# EAGLE design ADE7763_Breakout (EAGLE 7.4.0)
CNAME: ADE7763 Breakout; CREVISION: 0.1; DESIGNER: Tisham Dhar
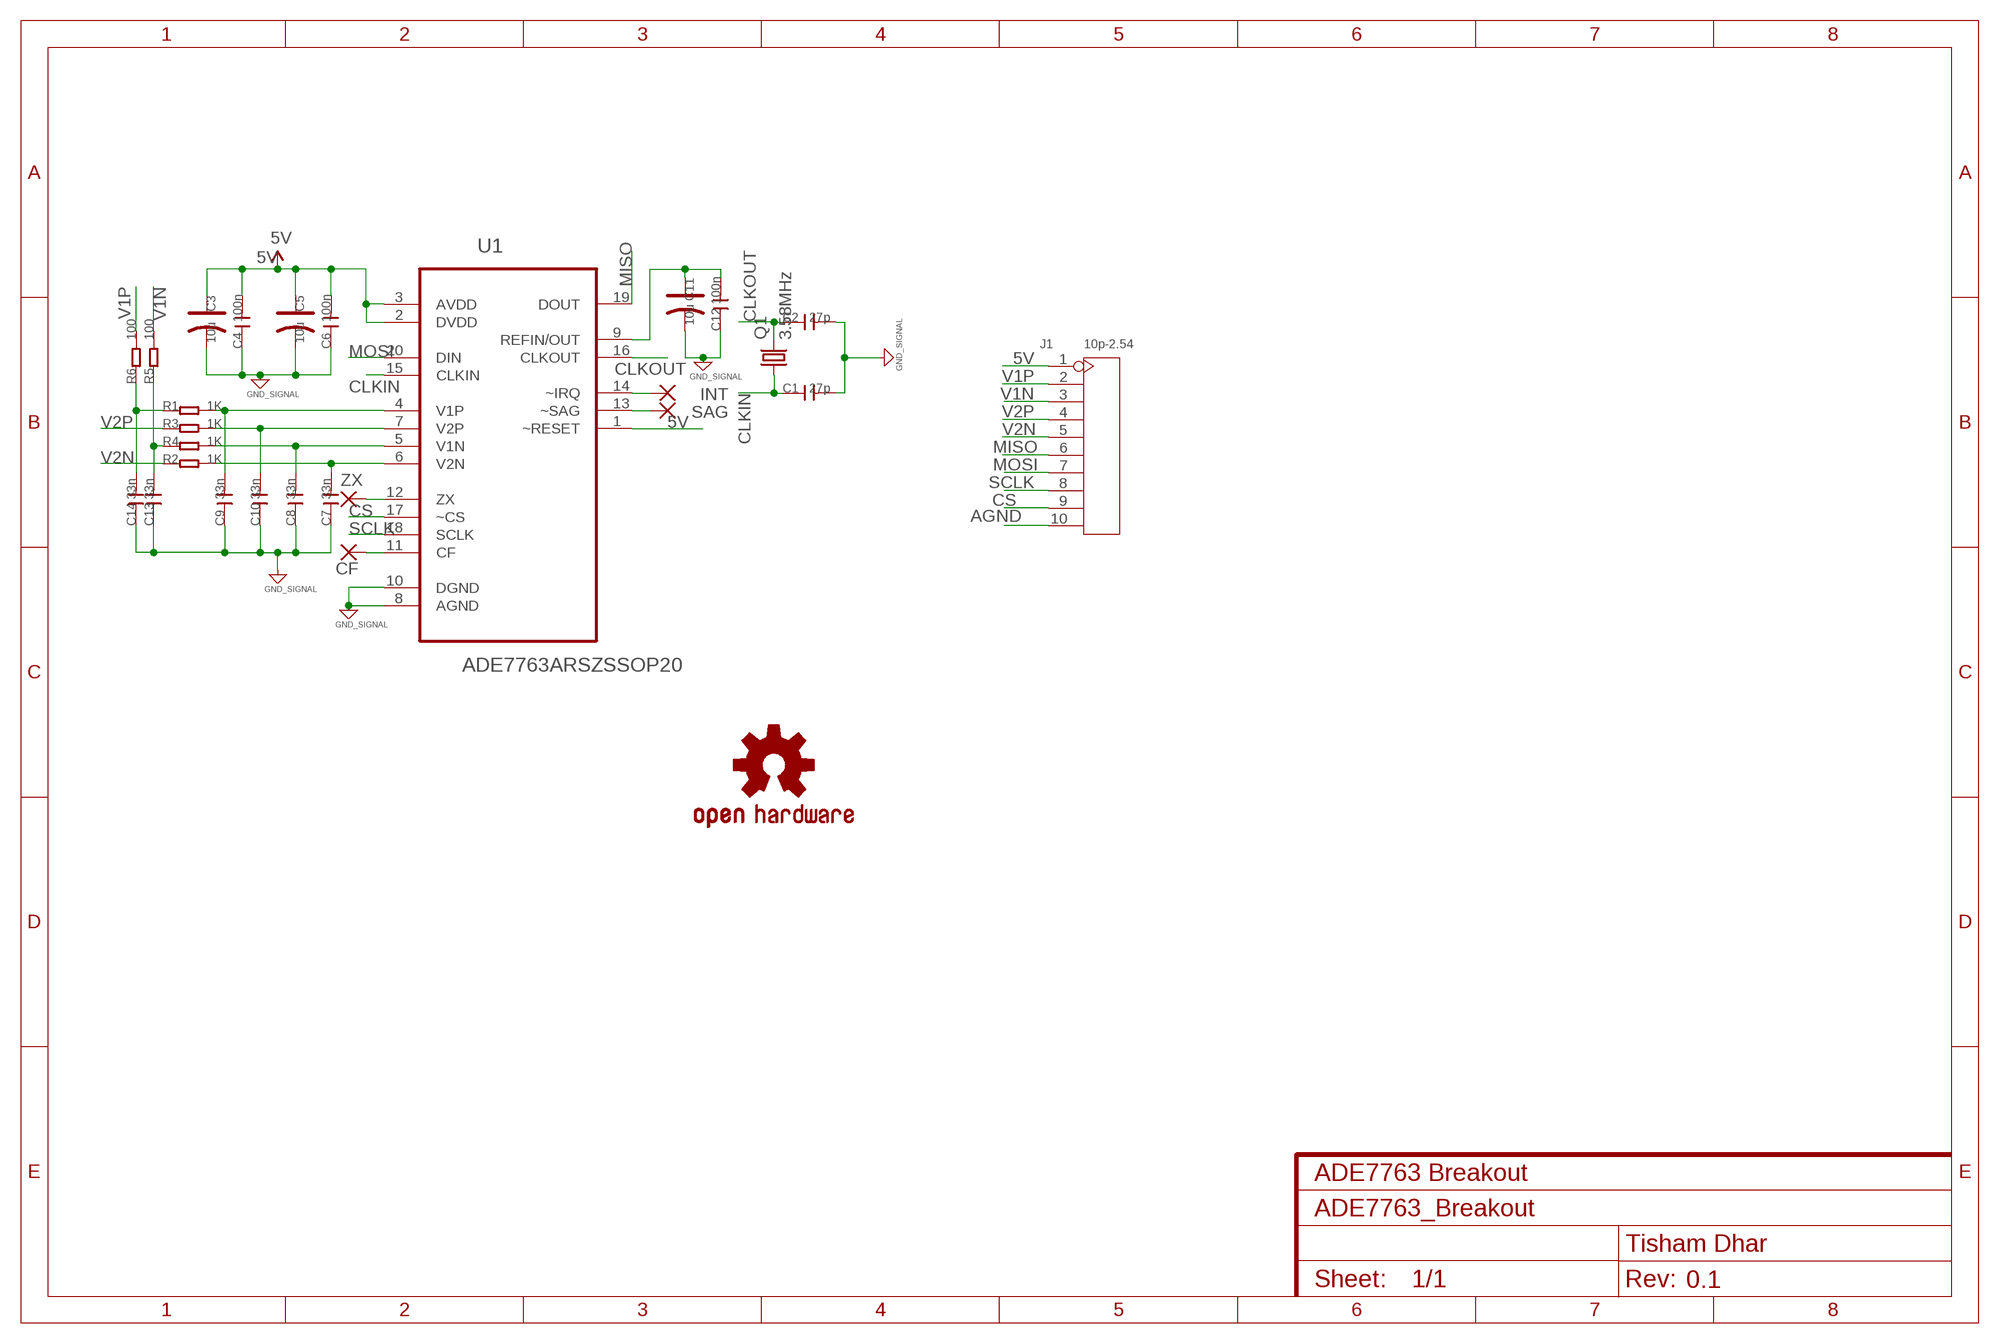
[diagram p0: schematic, sheet 1]

## Parts
C1  27p  C-0603  [C0603]
C2  27p  C-0603  [C0603]
C3  10u  CAP-AVX-A  [AVX-A]
C4  100n  C-0603  [C0603]
C5  10u  CAP-AVX-A  [AVX-A]
C6  100n  C-0603  [C0603]
C7  33n  C-0603  [C0603]
C8  33n  C-0603  [C0603]
C9  33n  C-0603  [C0603]
C10  33n  C-0603  [C0603]
C11  10u  CAP-AVX-A  [AVX-A]
C12  100n  C-0603  [C0603]
C13  33n  C-0603  [C0603]
C14  33n  C-0603  [C0603]
CF  WIREPADSMD1,27-254  [SMD1,27-2,54]
INT  WIREPADSMD1,27-254  [SMD1,27-2,54]
J1  10p-2.54  DIP-BLACK-MALE-HEADER-VERT(10P-2.54)  [H10-2.54]
LOGO1  OSHW-LOGOM  [OSHW-LOGO-M]
Q1  3.58MHz  CRYSTALHC49UP  [HC49UP]
R1  1K  R-0603  [R0603]
R2  1K  R-0603  [R0603]
R3  1K  R-0603  [R0603]
R4  1K  R-0603  [R0603]
R5  100  R-0603  [R0603]
R6  100  R-0603  [R0603]
SAG  WIREPADSMD1,27-254  [SMD1,27-2,54]
U1  ADE7763ARSZSSOP20  [RS_20-M]
ZX  WIREPADSMD1,27-254  [SMD1,27-2,54]

## Nets
5V [pwr]: C3.+ C4.2 C5.+ C6.2 J1.1 U1.1(~RESET) U1.2(DVDD) U1.3(AVDD)
AGND [pwr]: C1.2 C2.2 C3.- C4.1 C5.- C6.1 C7.1 C8.1 C9.1 C10.1 C11.- C12.1 C13.1 C14.1 J1.10 U1.8(AGND) U1.10(DGND) ; supply symbol labelled GND_SIGNAL
CLKIN: C1.1 Q1.1 U1.15(CLKIN)
CLKOUT: C2.1 Q1.2 U1.16(CLKOUT)
CS: J1.9 U1.17(~CS)
MISO: J1.6 U1.19(DOUT)
MOSI: J1.7 U1.20(DIN)
N$1: C13.2 R4.1 R5.1
N$2: C14.2 R1.1 R6.1
N$3: INT.1(P) U1.14(~IRQ)
N$4: C7.2 R2.2 U1.6(V2N)
N$5: C8.2 R4.2 U1.5(V1N)
N$6: C10.2 R3.2 U1.7(V2P)
N$7: C9.2 R1.2 U1.4(V1P)
N$8: SAG.1(P) U1.13(~SAG)
N$9: C11.+ C12.2 U1.9(REFIN/OUT)
N$10: U1.12(ZX) ZX.1(P)
N$11: CF.1(P) U1.11(CF)
SCLK: J1.8 U1.18(SCLK)
V1N: J1.3 R5.2
V1P: J1.2 R6.2
V2N: J1.5 R2.1
V2P: J1.4 R3.1

## Library data of the parts
C1 C2 C4 C6-C10 C12-C14 = Discrete:C*: Ceramic Capacitors
C3 C5 C11 = Discrete:CAP*: Electrolytic Capacitors,Tantalum Capacitors and Super Capacitors
CF INT SAG ZX = wirepad:WIREPAD: Wire PAD connect wire on PCB
J1 = Seeed-OPL-Connector:DIP-BLACK-MALE-HEADER-VERT(10P-2.54): 320020050; MPN: P125-1110A0BS116AX
LOGO1 = SparkFun-Aesthetics:OSHW-LOGO: Open Source Hardware Logo This logo indicates the piece of hardware it is found on incorporates a OSHW license and/or adheres to the definition of open source hardware found here: http://freedomdefined.org/OSHW
Q1 = crystal:CRYSTAL: CRYSTAL; OC_FARNELL: unknown; OC_NEWARK: unknown
R1-R6 = Discrete:R*
U1 = Analog Devices_By_element14_Batch_1:ADE7763ARSZ: Single-Phase Active and Apparent Energy Metering IC

## Net classes
0 default: width 0.254 mm, drill 0.33 mm, clearance 0.152 mm
1 pwr: width 0.406 mm, drill 0.33 mm, clearance 0.254 mm

## Board
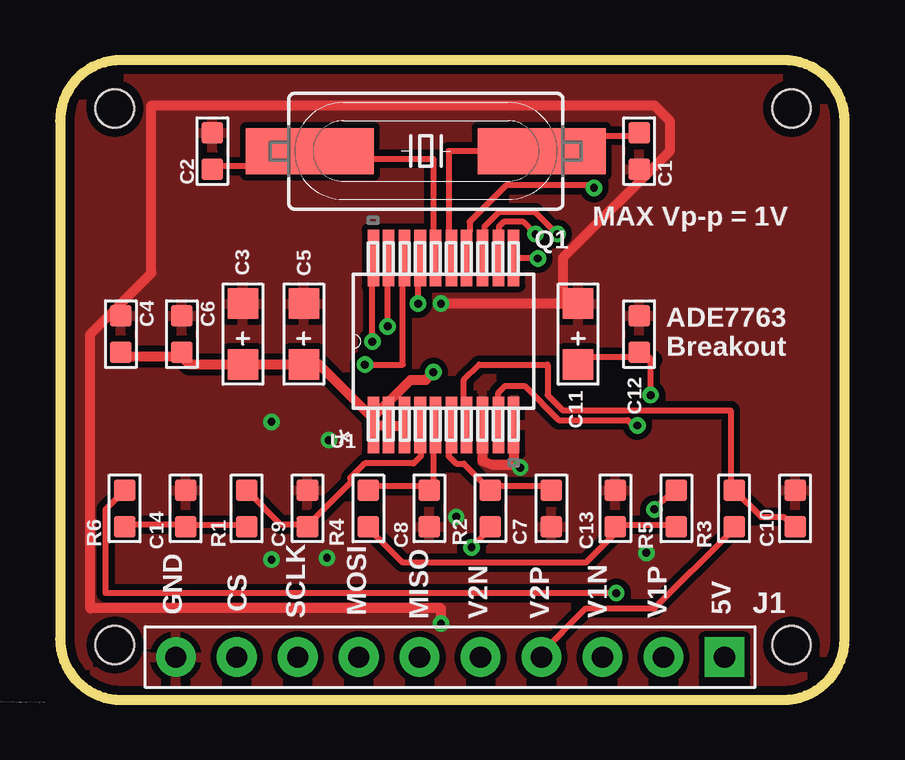
[diagram p1: board, top side]
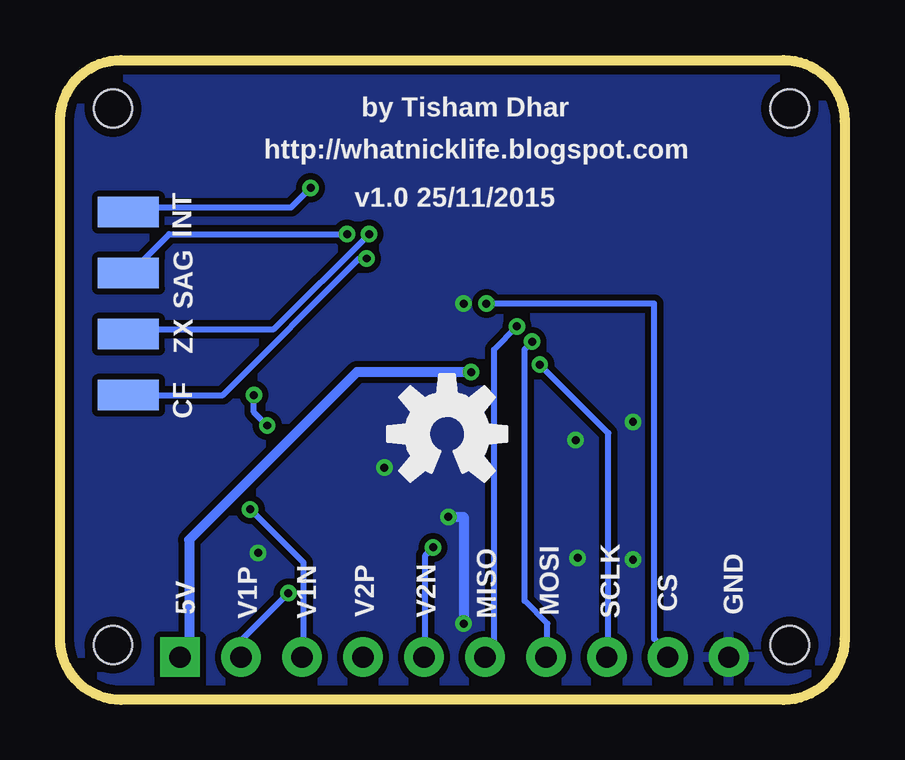
[diagram p2: board, bottom side, seen from below]

Size 32.69 x 26.66 mm. Coordinates in mm from the lower left corner, seen from the top.
Outline: 0,24.12 0,2.54 arc90 2.54,0 30.15,0 arc90 32.69,2.54 32.69,24.12 arc90 30.15,26.66 2.54,26.66 arc90 0,24.12
Copper layers (1*16): Top 0.0356mm / dielectric 1.5011mm / Bottom 0.0356mm
Design rules "OSHPark_2layer": minimum track width 6mil, minimum drill 13mil, track to track 6mil, track to pad 6mil, pad to pad 6mil, via to via 6mil, smd to smd 6mil, copper to edge 15mil, drill to drill 6mil, minimum pad ring 7mil, minimum via ring 7mil, stop-mask expansion 3mil, vias tented up to drill 20mil, thermal gap 10mil
Holes 1.6 mm at 2.29,24.64 30.48,24.64 2.29,2.29 30.48,2.29

### Footprints (pad centres in the part's own frame; a part is rotated, then mirrored left to right if it is on the bottom)
C0603 = smd 0.889 x 0.889: 1 -0.762,0; 2 0.762,0
AVX-A = smd 1.27 x 1.27: + -1.27,0; - 1.27,0
SMD1,27-2,54 = smd 1.27 x 2.54: 1 0,0
H10-2.54 = drill 0.889 pad 1.651 square: 1 0,11.43 | drill 0.889 pad 1.651: 2 0,8.89; 3 0,6.35; 4 0,3.81; 5 0,1.27; 6 0,-1.27; 7 0,-3.81; 8 0,-6.35; 9 0,-8.89; 10 0,-11.43
HC49UP = smd 5.334 x 1.93: 1 -4.826,0; 2 4.826,0
R0603 = smd 0.889 x 0.889: 1 -0.762,0; 2 0.762,0
RS_20-M = smd 2.362 x 0.483: 1 -3.48,2.921; 2 -3.48,2.286; 3 -3.48,1.626; 4 -3.48,0.965; 5 -3.48,0.33; 6 -3.48,-0.33; 7 -3.48,-0.965; 8 -3.48,-1.626; 9 -3.48,-2.286; 10 -3.48,-2.921; 11 3.48,-2.921; 12 3.48,-2.286; 13 3.48,-1.626; 14 3.48,-0.965; 15 3.48,-0.33; 16 3.48,0.33; 17 3.48,0.965; 18 3.48,1.626; 19 3.48,2.286; 20 3.48,2.921

### Placement (x,y rotation side)
C1  24.13,22.86 270 top
C2  6.35,22.86 90 top
C3  7.62,15.24 90 top
C4  2.54,15.24 270 top
C5  10.16,15.24 90 top
C6  5.08,15.24 270 top
C7  20.47,7.98 90 top
C8  15.39,7.98 90 top
C9  10.31,7.98 270 top
C10  30.63,7.98 270 top
C11  21.59,15.24 90 top
C12  24.13,15.24 270 top
C13  23.14,7.98 270 top
C14  5.23,7.98 270 top
CF  29.84,12.7 90 bottom
INT  29.84,20.32 90 bottom
J1  16.26,1.78 270 top
LOGO1  16.56,11.07 0 bottom
Q1  15.24,22.86 180 top
R1  7.77,7.98 90 top
R2  17.93,7.98 90 top
R3  28.09,7.98 90 top
R4  12.85,7.98 90 top
R5  25.68,7.98 90 top
R6  2.69,7.98 90 top
SAG  29.84,17.78 90 bottom
U1  15.98,14.94 90 top
ZX  29.84,15.24 90 bottom

### Tracks (layer width: path | path; a pad name or v marks a point on that pad's centre or on a via)
5V  (via drill 0.33)
  Top 0.406: 13.65,11.43 13.02,11.43 U1.1 13.02,11.75 | 13.65,11.43 14.29,11.43 U1.3 | 13.65,11.43 U1.2 | 5.08,14.29 2.54,14.29 C4.2 | 5.08,14.29 5.4,13.97 C3.+ C5.+ 10.8,13.97 13.02,11.75 | 5.08,14.29 C6.2 | v15.56,13.65 15.24,13.34 14.61,13.34 13.02,11.75
  Bottom 0.406: v15.56,13.65 20.32,13.65 27.3,6.67 27.3,2.22 27.62,1.91 J1.1
AGND  (via drill 0.33)
  Top 0.406: U1.8 17.63,11.46 17.6,9.96 18.01,9.8 19.05,9.8 v19.18,9.68 | v15.88,16.51 20.96,16.51 20.96,18.41 25.4,22.86 25.4,24.13 24.77,24.77 3.81,24.77 3.81,17.78 1.27,15.24 1.27,3.81 15.88,3.81 v15.88,3.17 | U1.10 18.9,9.93 18.95,9.88
  Bottom 0.406: v15.88,3.17 15.88,7.62 v16.51,7.62
  other vias: 8.81,11.58 11.2,10.82 8.81,5.84 11.13,5.92 24.43,6.12
  pour Top: 0,26.67 33.02,26.67 33.02,0 0,0
  pour Bottom: 0,26.67 33.02,26.67 33.02,0 0,0
CLKIN
  Top 0.254: C1.1 24.13,23.5 20.96,23.5 20.32,22.86 Q1.1 16.19,22.86 16.19,18.41 U1.15
CLKOUT
  Top 0.254: 9.84,22.54 10.16,22.86 Q1.2 9.84,22.54 | 9.84,22.54 9.52,22.23 6.35,22.23 C2.1 | 9.84,22.54 15.56,22.54 15.56,18.41 U1.16
CS  (via drill 0.33)
  Top 0.254: v14.92,16.51 14.92,18.41 U1.17
  Bottom 0.254: v14.92,16.51 7.94,16.51 7.94,2.54 7.62,2.22 7.62,1.91 J1.9
MISO  (via drill 0.33)
  Top 0.254: v13.65,15.56 13.65,18.41 U1.19
  Bottom 0.254: v13.65,15.56 14.61,14.61 14.61,2.22 14.92,1.91 J1.6
MOSI  (via drill 0.33)
  Top 0.254: v13.02,14.92 13.02,18.41 U1.20
  Bottom 0.254: v13.02,14.92 13.34,14.61 13.34,4.13 12.38,3.17 12.38,1.91 J1.7
N$1
  Top 0.254: R4.1 13.02,6.99 14.29,5.71 21.91,5.71 23.18,6.99 C13.2 23.18,7.3 25.4,7.3 R5.1
N$2
  Top 0.254: R6.1 2.86,7.3 5.08,7.3 C14.2 5.4,7.3 7.62,7.3 R1.1
N$3  (via drill 0.33)
  Top 0.254: v22.25,21.34 22.15,21.44 18.59,21.44 17.07,19.91 17.07,19.51 16.97,19.41 16.97,18.49 U1.14
  Bottom 0.254: v22.25,21.34 23.06,20.52 29.57,20.52 29.77,20.32 INT.1
N$4
  Top 0.254: C7.2 20.32,8.89 18.1,8.89 R2.2 16.83,9.84 16.51,9.84 16.19,10.16 16.19,11.43 U1.6
N$5
  Top 0.254: R4.2 13.02,8.89 15.24,8.89 C8.2 15.56,8.89 15.56,11.43 U1.5
N$6
  Top 0.254: C10.2 30.48,7.3 30.16,7.62 29.21,7.62 R3.2 27.94,8.89 27.94,12.06 20.96,12.06 20.32,12.7 20.32,13.97 17.46,13.97 16.83,13.34 16.83,11.75 U1.7
N$7
  Top 0.254: R1.2 9.21,7.3 10.16,7.3 C9.2 10.36,7.32 12.09,9.04 12.09,9.25 12.7,9.86 14.73,9.86 15.04,10.16 15.04,11.38 U1.4
N$8  (via drill 0.33)
  Top 0.254: v20.73,19.41 19.81,20.32 18.29,20.32 17.68,19.71 17.68,18.49 U1.13
  Bottom 0.254: v20.73,19.41 28.14,19.41 29.77,17.78 SAG.1
N$9  (via drill 0.33)
  Top 0.254: C11.+ 21.91,14.29 24.13,14.29 C12.2 24.33,14.48 24.54,14.28 24.61,14.17 | 23.96,11.34 23.65,11.66 20.78,11.66 19.36,13.08 18.54,13.08 18.26,12.8 U1.9 | 23.96,11.34 24.08,11.23 | 24.61,14.17 24.71,14.17 | v24.61,12.7 24.61,14.17 | v24.05,11.43 23.96,11.34
  Bottom 0.254: v24.61,12.7 24.61,11.99 v24.05,11.43
N$10  (via drill 0.33)
  Top 0.254: v19.81,19.41 19.3,19.91 18.49,19.91 18.29,19.71 18.29,18.49 U1.12
  Bottom 0.254: v19.81,19.41 23.77,15.44 29.57,15.44 29.77,15.24 ZX.1
N$11  (via drill 0.33)
  Top 0.254: v19.91,18.39 18.9,18.39 U1.11
  Bottom 0.254: v19.91,18.39 20.22,18.39 25.91,12.7 CF.1
SCLK  (via drill 0.33)
  Top 0.254: v12.7,13.97 14.29,13.97 14.29,18.41 U1.18
  Bottom 0.254: v12.7,13.97 9.84,11.11 9.84,1.91 J1.8
V1N  (via drill 0.33)
  Top 0.254: v24.77,7.94 25.4,8.57 R5.2
  Bottom 0.254: v24.77,7.94 22.54,5.71 22.54,1.91 J1.3
V1P  (via drill 0.33)
  Top 0.254: v23.18,4.45 1.91,4.45 1.91,7.94 2.54,8.57 R6.2
  Bottom 0.254: v23.18,4.45 25.08,2.54 25.08,1.91 J1.2
V2N  (via drill 0.33)
  Top 0.254: v17.14,6.35 17.78,6.99 R2.1
  Bottom 0.254: v17.14,6.35 17.46,6.03 17.46,1.91 J1.5
V2P
  Top 0.254: R3.1 27.94,6.99 24.77,3.81 21.91,3.81 20,1.91 J1.4

### Text on the board
tPlace: MAX Vp-p = 1V | ADE7763 / Breakout | GND | CS | MOSI | 5V | SCLK | MISO | V2N | V2P | V1N | V1P | C:/Users/tisham/Pictures/Artwork/whatnick_elec_logo.bmp
bPlace: by Tisham Dhar | http://whatnicklife.blogspot.com | v1.0 25/11/2015 | GND | CS | MOSI | 5V | SCLK | MISO | V2N | V2P | V1N | V1P